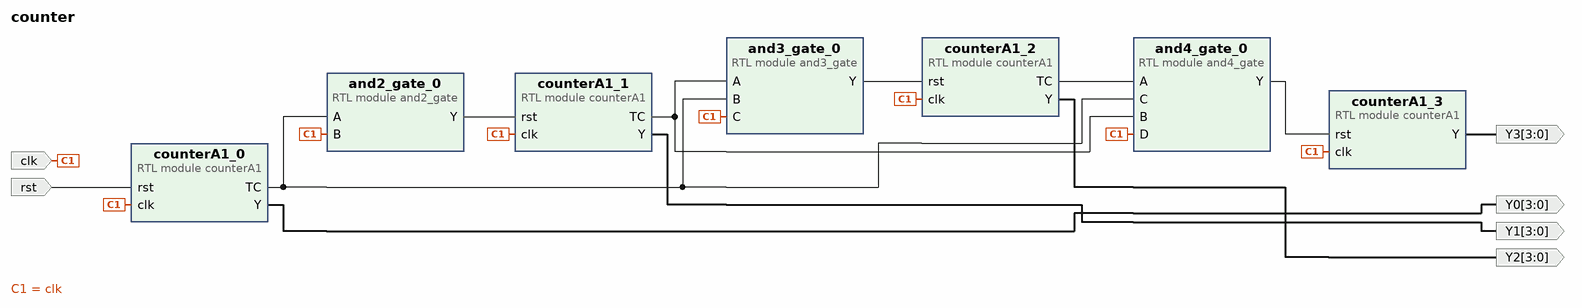
[diagram p0: block diagram of the top level]
# Vivado block design counter, xc7z007sclg400-1, Vivado 2024.1.1
create_bd_design counter

create_bd_port -dir I clk
create_bd_port -dir I rst
create_bd_port -dir O -from 3 -to 0 Y0
create_bd_port -dir O -from 3 -to 0 Y1
create_bd_port -dir O -from 3 -to 0 Y2
create_bd_port -dir O -from 3 -to 0 Y3

create_bd_cell -type module -reference counterA1 counterA1_0
create_bd_cell -type module -reference counterA1 counterA1_1
create_bd_cell -type module -reference counterA1 counterA1_2
create_bd_cell -type module -reference counterA1 counterA1_3
create_bd_cell -type module -reference and2_gate and2_gate_0
create_bd_cell -type module -reference and3_gate and3_gate_0
create_bd_cell -type module -reference and4_gate and4_gate_0

# ---- connections ----

connect_bd_net [get_bd_pins and2_gate_0/Y] [get_bd_pins counterA1_1/rst]
connect_bd_net [get_bd_pins and3_gate_0/Y] [get_bd_pins counterA1_2/rst]
connect_bd_net [get_bd_pins and4_gate_0/Y] [get_bd_pins counterA1_3/rst]
connect_bd_net [get_bd_ports clk] \
  [get_bd_pins counterA1_0/clk] [get_bd_pins counterA1_1/clk] [get_bd_pins counterA1_2/clk] [get_bd_pins counterA1_3/clk] \
  [get_bd_pins and2_gate_0/B] [get_bd_pins and3_gate_0/C] [get_bd_pins and4_gate_0/D]
connect_bd_net [get_bd_pins counterA1_0/TC] [get_bd_pins and2_gate_0/A] [get_bd_pins and3_gate_0/B] [get_bd_pins and4_gate_0/C]
connect_bd_net [get_bd_pins counterA1_0/Y] [get_bd_ports Y0]
connect_bd_net [get_bd_pins counterA1_1/TC] [get_bd_pins and3_gate_0/A] [get_bd_pins and4_gate_0/B]
connect_bd_net [get_bd_pins counterA1_1/Y] [get_bd_ports Y1]
connect_bd_net [get_bd_pins counterA1_2/TC] [get_bd_pins and4_gate_0/A]
connect_bd_net [get_bd_pins counterA1_2/Y] [get_bd_ports Y2]
connect_bd_net [get_bd_pins counterA1_3/Y] [get_bd_ports Y3]
connect_bd_net [get_bd_ports rst] [get_bd_pins counterA1_0/rst]

validate_bd_design
save_bd_design
